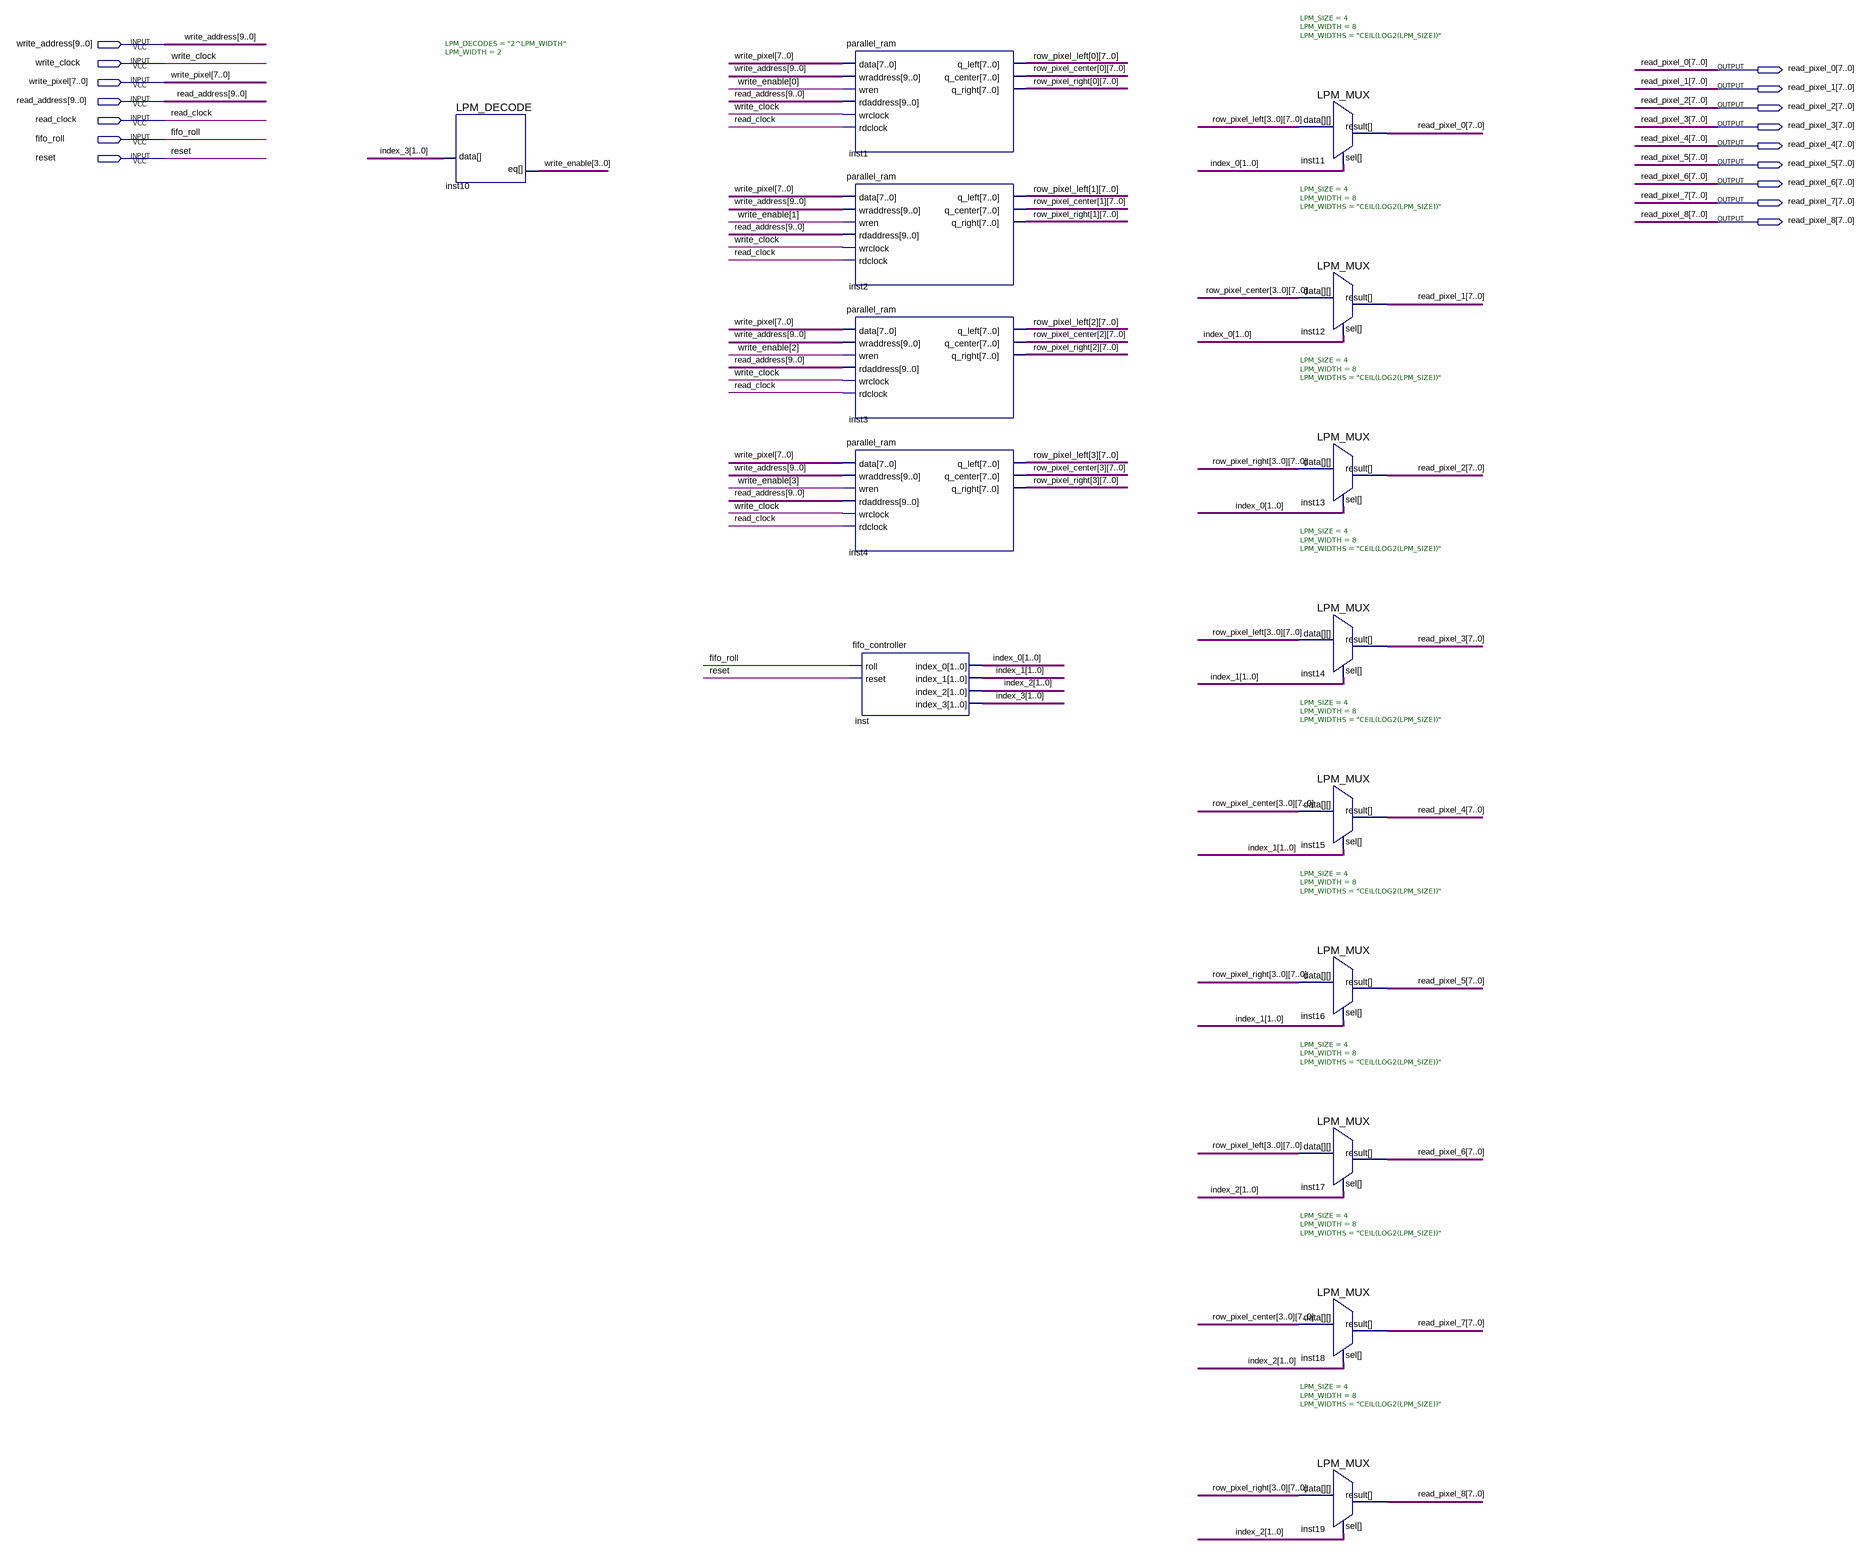
[diagram p0: schematic sheet]
// Quartus schematic row_fifo.bdf as structural Verilog: 15 symbols, 16 pins
module row_fifo (
  input  [9:0] write_address,
  input  write_clock,
  input  [7:0] write_pixel,
  input  [9:0] read_address,
  input  read_clock,
  input  fifo_roll,
  input  reset,
  output [7:0] read_pixel_0,
  output [7:0] read_pixel_1,
  output [7:0] read_pixel_2,
  output [7:0] read_pixel_3,
  output [7:0] read_pixel_4,
  output [7:0] read_pixel_5,
  output [7:0] read_pixel_6,
  output [7:0] read_pixel_7,
  output [7:0] read_pixel_8
);

  wire [1:0] index_0, index_1, index_2, index_3;
  wire [3:0] write_enable;
  wire [7:0] row_pixel_center_0, row_pixel_center_1, row_pixel_center_2, row_pixel_center_3,
       row_pixel_left_0, row_pixel_left_1, row_pixel_left_2, row_pixel_left_3, row_pixel_right_0,
       row_pixel_right_1, row_pixel_right_2, row_pixel_right_3;

  LPM_DECODE #(.LPM_DECODES("2^LPM_WIDTH"), .LPM_WIDTH(2)) inst10 (.data(index_3), .eq(write_enable));
  parallel_ram inst1 (
    .data(write_pixel), .wraddress(write_address), .wren(write_enable[0]), .rdaddress(read_address),
    .wrclock(write_clock), .rdclock(read_clock), .q_left(row_pixel_left_0), .q_center(row_pixel_center_0),
    .q_right(row_pixel_right_0));
  parallel_ram inst2 (
    .data(write_pixel), .wraddress(write_address), .wren(write_enable[1]), .rdaddress(read_address),
    .wrclock(write_clock), .rdclock(read_clock), .q_left(row_pixel_left_1), .q_center(row_pixel_center_1),
    .q_right(row_pixel_right_1));
  parallel_ram inst3 (
    .data(write_pixel), .wraddress(write_address), .wren(write_enable[2]), .rdaddress(read_address),
    .wrclock(write_clock), .rdclock(read_clock), .q_left(row_pixel_left_2), .q_center(row_pixel_center_2),
    .q_right(row_pixel_right_2));
  parallel_ram inst4 (
    .data(write_pixel), .wraddress(write_address), .wren(write_enable[3]), .rdaddress(read_address),
    .wrclock(write_clock), .rdclock(read_clock), .q_left(row_pixel_left_3), .q_center(row_pixel_center_3),
    .q_right(row_pixel_right_3));
  fifo_controller inst (
    .roll(fifo_roll), .reset(reset), .index_0(index_0), .index_1(index_1), .index_2(index_2),
    .index_3(index_3));
  LPM_MUX #(.LPM_SIZE(4), .LPM_WIDTH(8), .LPM_WIDTHS("CEIL(LOG2(LPM_SIZE))")) inst11 (
    .data({row_pixel_left_3, row_pixel_left_2, row_pixel_left_1, row_pixel_left_0}), .sel(index_0),
    .result(read_pixel_0));
  LPM_MUX #(.LPM_SIZE(4), .LPM_WIDTH(8), .LPM_WIDTHS("CEIL(LOG2(LPM_SIZE))")) inst12 (
    .data({row_pixel_center_3, row_pixel_center_2, row_pixel_center_1, row_pixel_center_0}), .sel(index_0),
    .result(read_pixel_1));
  LPM_MUX #(.LPM_SIZE(4), .LPM_WIDTH(8), .LPM_WIDTHS("CEIL(LOG2(LPM_SIZE))")) inst13 (
    .data({row_pixel_right_3, row_pixel_right_2, row_pixel_right_1, row_pixel_right_0}), .sel(index_0),
    .result(read_pixel_2));
  LPM_MUX #(.LPM_SIZE(4), .LPM_WIDTH(8), .LPM_WIDTHS("CEIL(LOG2(LPM_SIZE))")) inst14 (
    .data({row_pixel_left_3, row_pixel_left_2, row_pixel_left_1, row_pixel_left_0}), .sel(index_1),
    .result(read_pixel_3));
  LPM_MUX #(.LPM_SIZE(4), .LPM_WIDTH(8), .LPM_WIDTHS("CEIL(LOG2(LPM_SIZE))")) inst15 (
    .data({row_pixel_center_3, row_pixel_center_2, row_pixel_center_1, row_pixel_center_0}), .sel(index_1),
    .result(read_pixel_4));
  LPM_MUX #(.LPM_SIZE(4), .LPM_WIDTH(8), .LPM_WIDTHS("CEIL(LOG2(LPM_SIZE))")) inst16 (
    .data({row_pixel_right_3, row_pixel_right_2, row_pixel_right_1, row_pixel_right_0}), .sel(index_1),
    .result(read_pixel_5));
  LPM_MUX #(.LPM_SIZE(4), .LPM_WIDTH(8), .LPM_WIDTHS("CEIL(LOG2(LPM_SIZE))")) inst17 (
    .data({row_pixel_left_3, row_pixel_left_2, row_pixel_left_1, row_pixel_left_0}), .sel(index_2),
    .result(read_pixel_6));
  LPM_MUX #(.LPM_SIZE(4), .LPM_WIDTH(8), .LPM_WIDTHS("CEIL(LOG2(LPM_SIZE))")) inst18 (
    .data({row_pixel_center_3, row_pixel_center_2, row_pixel_center_1, row_pixel_center_0}), .sel(index_2),
    .result(read_pixel_7));
  LPM_MUX #(.LPM_SIZE(4), .LPM_WIDTH(8), .LPM_WIDTHS("CEIL(LOG2(LPM_SIZE))")) inst19 (
    .data({row_pixel_right_3, row_pixel_right_2, row_pixel_right_1, row_pixel_right_0}), .sel(index_2),
    .result(read_pixel_8));
endmodule
